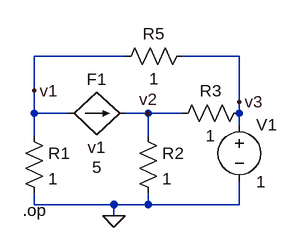
[diagram p0: schematic current1.asc]
current1.asc, the LTspice schematic file:
Version 4
SHEET 1 880 680
WIRE 160 32 32 32
WIRE 320 32 240 32
WIRE 32 80 32 32
WIRE 320 96 320 32
WIRE 32 112 32 80
WIRE 80 112 32 112
WIRE 192 112 160 112
WIRE 240 112 192 112
WIRE 320 112 320 96
WIRE 320 128 320 112
WIRE 32 144 32 112
WIRE 192 144 192 112
WIRE 32 240 32 224
WIRE 144 240 32 240
WIRE 192 240 192 224
WIRE 192 240 144 240
WIRE 320 240 320 208
WIRE 320 240 192 240
WIRE 144 256 144 240
FLAG 144 256 0
FLAG 320 96 v3
FLAG 32 80 v1
FLAG 192 112 v2
DATAFLAG 320 80 ""
DATAFLAG 176 112 ""
DATAFLAG 48 112 ""
SYMBOL res 16 128 R0
SYMATTR InstName R1
SYMATTR Value 1
SYMBOL res 176 128 R0
SYMATTR InstName R2
SYMATTR Value 1
SYMBOL res 336 96 R90
WINDOW 0 0 56 VBottom 2
WINDOW 3 32 56 VTop 2
SYMATTR InstName R3
SYMATTR Value 1
SYMBOL res 256 16 R90
WINDOW 0 0 56 VBottom 2
WINDOW 3 32 56 VTop 2
SYMATTR InstName R5
SYMATTR Value 1
SYMBOL f 80 112 R270
WINDOW 0 32 40 VTop 2
WINDOW 3 -32 40 VBottom 2
WINDOW 123 -60 40 VBottom 2
SYMATTR InstName F1
SYMATTR Value v1
SYMATTR Value2 5
SYMBOL voltage 320 112 R0
WINDOW 123 0 0 Left 0
WINDOW 39 0 0 Left 0
SYMATTR InstName V1
SYMATTR Value 1
TEXT 16 248 Left 2 !.op

The netlist it stands for:
* current1.asc
R1 v1 0 1
R2 v2 0 1
R3 v3 v2 1
R5 v3 v1 1
F1 v1 v2 v1 5
V1 v3 0 1
.op
.backanno
.end